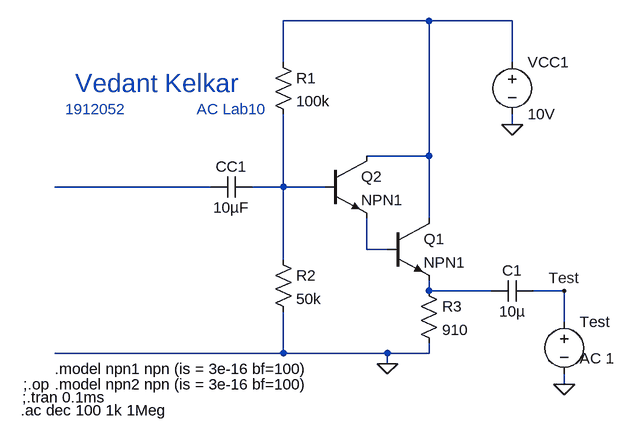
[diagram p0: schematic AC_Lab10b.asc]
AC_Lab10b.asc, the LTspice schematic file:
Version 4
SHEET 1 880 680
WIRE 272 -112 48 -112
WIRE 400 -112 272 -112
WIRE 48 -48 48 -112
WIRE 400 -48 400 -112
WIRE 400 48 400 32
WIRE 272 96 272 -112
WIRE 272 96 176 96
WIRE -64 144 -304 144
WIRE 48 144 48 32
WIRE 48 144 0 144
WIRE 112 144 48 144
WIRE 272 192 272 96
WIRE 176 240 176 192
WIRE 208 240 176 240
WIRE 48 256 48 144
WIRE 272 304 272 288
WIRE 368 304 272 304
WIRE 480 304 432 304
WIRE 480 352 480 304
WIRE 48 400 48 336
WIRE 48 400 -304 400
WIRE 208 400 48 400
WIRE 272 400 272 384
WIRE 272 400 208 400
WIRE 208 416 208 400
WIRE 480 448 480 432
FLAG 400 48 0
FLAG 208 416 0
FLAG 480 304 Test
FLAG 480 448 0
SYMBOL res 32 -64 R0
SYMATTR InstName R1
SYMATTR Value 100k
SYMBOL res 32 240 R0
SYMATTR InstName R2
SYMATTR Value 50k
SYMBOL npn 208 192 R0
SYMATTR InstName Q1
SYMATTR Value NPN1
SYMBOL cap 0 128 R90
WINDOW 0 0 32 VBottom 2
WINDOW 3 32 32 VTop 2
SYMATTR InstName CC1
SYMATTR Value 10µF
SYMBOL voltage 400 -64 R0
SYMATTR InstName VCC1
SYMATTR Value 10V
SYMBOL npn 112 96 R0
SYMATTR InstName Q2
SYMATTR Value NPN1
SYMBOL res 256 288 R0
SYMATTR InstName R3
SYMATTR Value 910
SYMBOL cap 432 288 R90
WINDOW 0 0 32 VBottom 2
WINDOW 3 32 32 VTop 2
SYMATTR InstName C1
SYMATTR Value 10µ
SYMBOL voltage 480 336 R0
WINDOW 123 24 72 Left 2
WINDOW 39 0 0 Left 0
WINDOW 3 24 44 Left 2
SYMATTR Value2 AC 1
SYMATTR InstName Test
SYMATTR Value ""
TEXT -272 -16 Left 4 ;Vedant Kelkar
TEXT -288 24 Left 2 ;1912052                AC Lab10
TEXT -304 424 Left 2 !.model npn1 npn (is = 3e-16 bf=100)
TEXT -352 448 Left 2 !;.op
TEXT -304 448 Left 2 !.model npn2 npn (is = 3e-16 bf=100)
TEXT -354 468 Left 2 !;.tran 0.1ms
TEXT -356 488 Left 2 !.ac dec 100 1k 1Meg

The netlist it stands for:
* AC_Lab10b.asc
R1 N001 N003 100k
R2 N003 0 50k
Q1 N001 N004 N005 0 NPN1
CC1 N003 N002 10µF
VCC1 N001 0 10V
Q2 N001 N003 N004 0 NPN1
R3 N005 0 910
C1 Test N005 10µ
V§Test Test 0 AC 1
.model NPN NPN
.model PNP PNP
.lib standard.bjt
* Vedant Kelkar
* 1912052                AC Lab10
.model npn1 npn (is = 3e-16 bf=100)
;.op
.model npn2 npn (is = 3e-16 bf=100)
;.tran 0.1ms
.ac dec 100 1k 1Meg
.backanno
.end